# EAGLE design i2c_adc_avr (EAGLE 6.4)
DATABASE: /home/mes/eagle/PARTSDB.txt
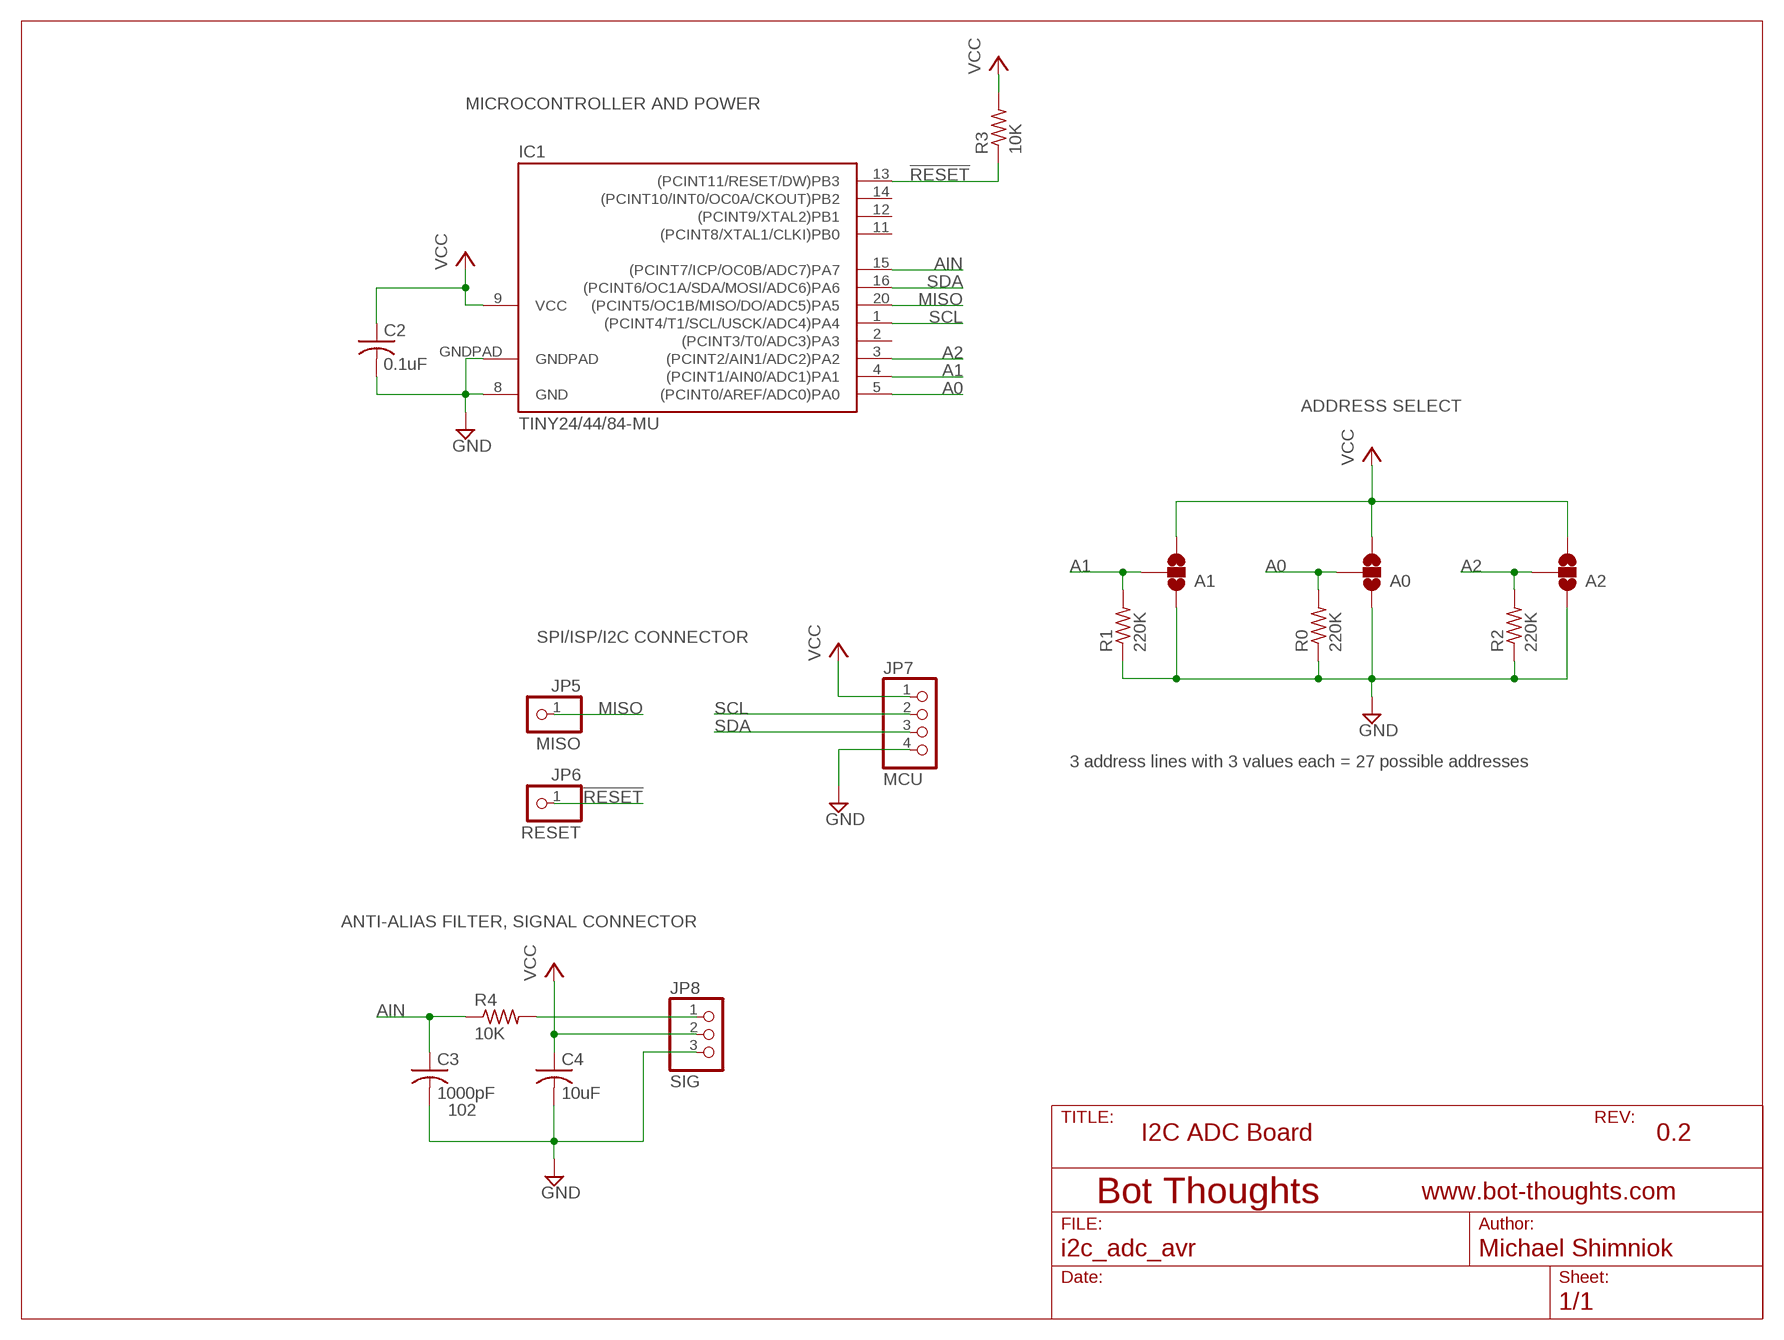
[diagram p0: schematic, sheet 1]

## Parts
A0  SOLDERJUMPER_2WAYS  [SJ_3]
A1  SOLDERJUMPER_2WAYS  [SJ_3]
A2  SOLDERJUMPER_2WAYS  [SJ_3]
C2  0.1uF  C-USC0603  [C0603]
C3  1000pF  C-USC0603  [C0603]
C4  10uF  C-USC0603  [C0603]
IC1  TINY24/44/84-MU  [QFN/MLF20]
JP5  MISO  PINHD-1X01_2.54  [1X01]
JP6  RESET  PINHD-1X01_2.54  [1X01]
JP7  MCU  PINHD-1X04_2.54-S  [1X04-S]
JP8  SIG  PINHD-1X03_2.00  [1X03M]
R0  220K  R-US_R0603  [R0603]
R1  220K  R-US_R0603  [R0603]
R2  220K  R-US_R0603  [R0603]
R3  10K  R-US_R0603  [R0603]
R4  10K  R-US_R0603  [R0603]

## Nets
!RESET: IC1.13((PCINT11/RESET/DW)PB3) JP6.1 R3.1
A0: A0.2 IC1.5((PCINT0/AREF/ADC0)PA0) R0.2
A1: A1.2 IC1.4((PCINT1/AIN0/ADC1)PA1) R1.2
A2: A2.2 IC1.3((PCINT2/AIN1/ADC2)PA2) R2.2
AIN: C3.1 IC1.15((PCINT7/ICP/OC0B/ADC7)PA7) R4.1
GND: A0.1 A1.1 A2.1 C2.2 C3.2 C4.2 IC1.8(GND) IC1.GNDPAD JP7.4 JP8.3 R0.1 R1.1 R2.1
MISO: IC1.20((PCINT5/OC1B/MISO/DO/ADC5)PA5) JP5.1
N$1: JP8.1 R4.2
SCL: IC1.1((PCINT4/T1/SCL/USCK/ADC4)PA4) JP7.2
SDA: IC1.16((PCINT6/OC1A/SDA/MOSI/ADC6)PA6) JP7.3
VCC: A0.3 A1.3 A2.3 C2.1 C4.1 IC1.9(VCC) JP7.1 JP8.2 R3.2
Unconnected: IC1.2((PCINT3/T0/ADC3)PA3) IC1.11((PCINT8/XTAL1/CLKI)PB0) IC1.12((PCINT9/XTAL2)PB1) IC1.14((PCINT10/INT0/OC0A/CKOUT)PB2)

## Notes on the sheet
- MICROCONTROLLER AND POWER
- ADDRESS SELECT
- SPI/ISP/I2C CONNECTOR
- 3 address lines with 3 values each = 27 possible addresses
- ANTI-ALIAS FILTER, SIGNAL CONNECTOR
- I2C ADC Board | 0.2

## Library data of the parts
A0 A1 A2 = SparkFun:SOLDERJUMPER_2WAY: Solder Jumper 2 way solder jumper
C2 = rcl:C-US: CAPACITOR, American symbol; PARTNO: C1608X7R1E104K080AA
C3 = rcl:C-US: CAPACITOR, American symbol; CODE: 102; PARTNO: CL10B102KB8SFNC
C4 = rcl:C-US: CAPACITOR, American symbol; PARTNO: CL10A106MP8NNNC
IC1 = avr-4:TINY24/44/84; PARTNO: ATTINY44A-MU
JP5 JP6 = pinhead-2:PINHD-1X01: PIN HEADER
JP7 = pinhead-2:PINHD-1X04: PIN HEADER
JP8 = pinhead-2:PINHD-1X03: PIN HEADER
R0 R1 R2 = rcl:R-US_: RESISTOR, American symbol; PARTNO: RC1608J224CS
R3 R4 = rcl:R-US_: RESISTOR, American symbol; PARTNO: 1622829-1

## Board
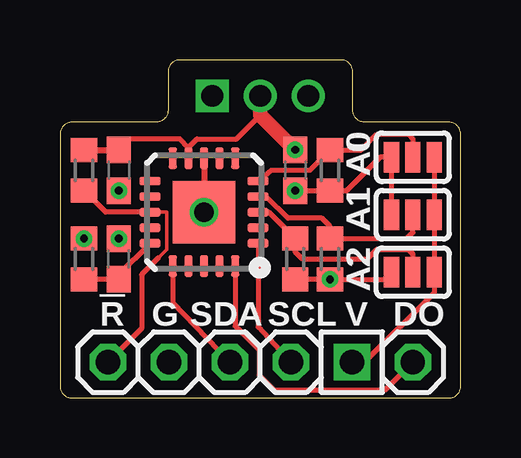
[diagram p1: board, top side]
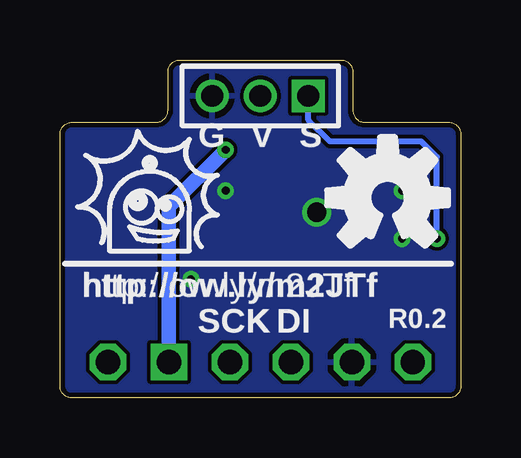
[diagram p2: board, bottom side, seen from below]

Size 16.7 x 14.1 mm. Coordinates in mm from the lower left corner, seen from the top.
Outline: 12.2,12 12.2,13.6 arc90 11.7,14.1 5,14.1 arc90 4.5,13.6 4.5,12 arc-90 4,11.5 0.5,11.5 arc90 0,11 0,0.5 arc90 0.5,0 16.2,0 arc90 16.7,0.5 16.7,11 arc90 16.2,11.5 12.7,11.5 arc-90 12.2,12
Copper layers (1*16): Top 0.0356mm / dielectric 1.5011mm / Bottom 0.0356mm
Design rules "default *": minimum track width 6mil, minimum drill 13mil, track to track 6mil, track to pad 6mil, pad to pad 6mil, via to via 6mil, smd to smd 6mil, copper to edge 8mil, drill to drill 6mil, minimum pad ring 7mil, minimum via ring 7mil, stop-mask expansion 4mil, vias tented up to drill 20mil, thermal gap 10mil

### Footprints (pad centres in the part's own frame; a part is rotated, then mirrored left to right if it is on the bottom)
SJ_3 = smd 0.635 x 1.27: 1 -0.889,0; 2 0,0; 3 0.889,0
C0603 = smd 1.1 x 1: 1 -0.85,0; 2 0.85,0
QFN/MLF20 = smd 0.9 x 0.35: 1 -2.25,1.3; 2 -2.25,0.65; 3 -2.25,0; 4 -2.25,-0.65; 5 -2.25,-1.3; 11 2.25,-1.3; 12 2.25,-0.65; 13 2.25,0; 14 2.25,0.65; 15 2.25,1.3 | smd 0.35 x 0.9: 6 -1.3,-2.25; 7 -0.65,-2.25; 8 0,-2.25; 9 0.65,-2.25; 10 1.3,-2.25; 16 1.3,2.25; 17 0.65,2.25; 18 0,2.25; 19 -0.65,2.25; 20 -1.3,2.25 | smd 2.6 x 2.6: GNDPAD 0,0
1X01 = drill 1.016 octagon: 1 0,0
1X04-S = drill 1.016 square: 1 -3.81,0 | drill 1.016 octagon: 2 -1.27,0; 3 1.27,0; 4 3.81,0
1X03M = drill 0.914 square: 1 -2,0 | drill 0.914: 2 0,0; 3 2,0
R0603 = smd 1 x 1.1: 1 -0.85,0; 2 0.85,0

### Placement (x,y rotation side)
A0  14.7,10.04 0 top
A1  14.7,7.64 0 top
A2  14.7,5.24 0 top
C2  2.45,9.5 270 top
C3  2.45,5.8 90 top
C4  9.8,9.5 270 top
IC1  6,7.75 180 top
JP5  14.7,1.49 0 top
JP6  2,1.49 0 top
JP7  8.35,1.49 180 top
JP8  8.35,12.6 180 bottom
R0  11.25,9.5 90 top
R1  11.25,5.8 90 top
R2  9.8,5.8 90 top
R3  1,9.5 90 top
R4  1,5.8 90 top

### Tracks (layer width: path | path; a pad name or v marks a point on that pad's centre or on a via)
!RESET
  Top 0.152: IC1.13 4.45,7.75 4.45,6.2 4.1,5.85
  Top 0.203: IC1.13 1.9,7.75 R3.1 | 4.1,5.85 3.4,5.15 3.4,2.9 JP6.1
A0
  Top 0.203: IC1.5 8.8,9.5 10.4,9.5 R0.2 12.55,10.35 13.2,11 14.5,11 14.7,10.8 A0.2
A1
  Top 0.152: IC1.4 8.6,8.4
  Top 0.203: A1.2 14.7,6.9 14.45,6.65 R1.2 11.25,7.15 10.9,7.5 9.5,7.5 8.6,8.4
A2
  Top 0.203: A2.2 14.7,6 14.5,6.2 13.2,6.2 12.8,5.8 10.1,5.8 9.8,6.1 R2.2 8.7,7.75 IC1.3
AIN
  Top 0.203: R4.1 C3.1 2.45,5.15 IC1.15
GND  (via drill 0.33, 0.8)
  Top 0.203: C4.2 R0.1 11.95,8.65 13.34,10.04 A0.1 A1.1 | R2.1 R1.1 13.52,4.95 A2.1
  Top 0.254: IC1.8 IC1.GNDPAD
  other vias: 6,7.75 2.45,8.65 2.45,6.65 9.8,8.65 11.25,4.95
  pour Bottom: 0,11.5 4.5,11.5 4.5,14.1 12.2,14.1 12.25,11.5 16.7,11.5 16.7,0 0,0
MISO
  Top 0.203: IC1.20 7.3,3 8.3,2 8.3,0.95 8.9,0.35 13.56,0.35 JP5.1
N$1  (via drill 0.33)
  Bottom 0.254: R4.2 1,10.05 1.65,10.7 5.45,10.7 6.35,11.6 JP8.1
  other vias: 1,6.65
SCL
  Top 0.203: IC1.1 8.25,2.96 JP7.2
SDA
  Top 0.203: IC1.16 4.7,3.97 JP7.3
VCC  (via drill 0.33)
  Top 0.203: A0.3 A1.3 A2.3 15.59,4.39 12.7,1.5 JP7.1 | C2.1 2.9,10.8 5,10.8 5.35,10.45 | IC1.9 5.35,10.45 | 5.35,10.45 5.7,10.8 7.35,10.8 8.35,11.8
  Top 0.254: R3.2 C2.1
  Top 0.61: C4.1 8.35,11.8 JP8.2
  Bottom 0.61: C4.1 12.16,7.99 JP7.1
  other vias: 9.8,10.35

### Text on the board
bPlace: http://ow.ly/m2JTf | R0.2
tNames: !R | G | SDA | SCL | V | DO
bNames: S | V | G | DI | SCK
tsilk: A0 | A1 | A2 | !R | G | SDA | SCL | V | DO
bsilk: S | V | G | http://ow.ly/m2JTf | R0.2 | DI | SCK